# Altium schematic sheet audio.SchDoc
size A3
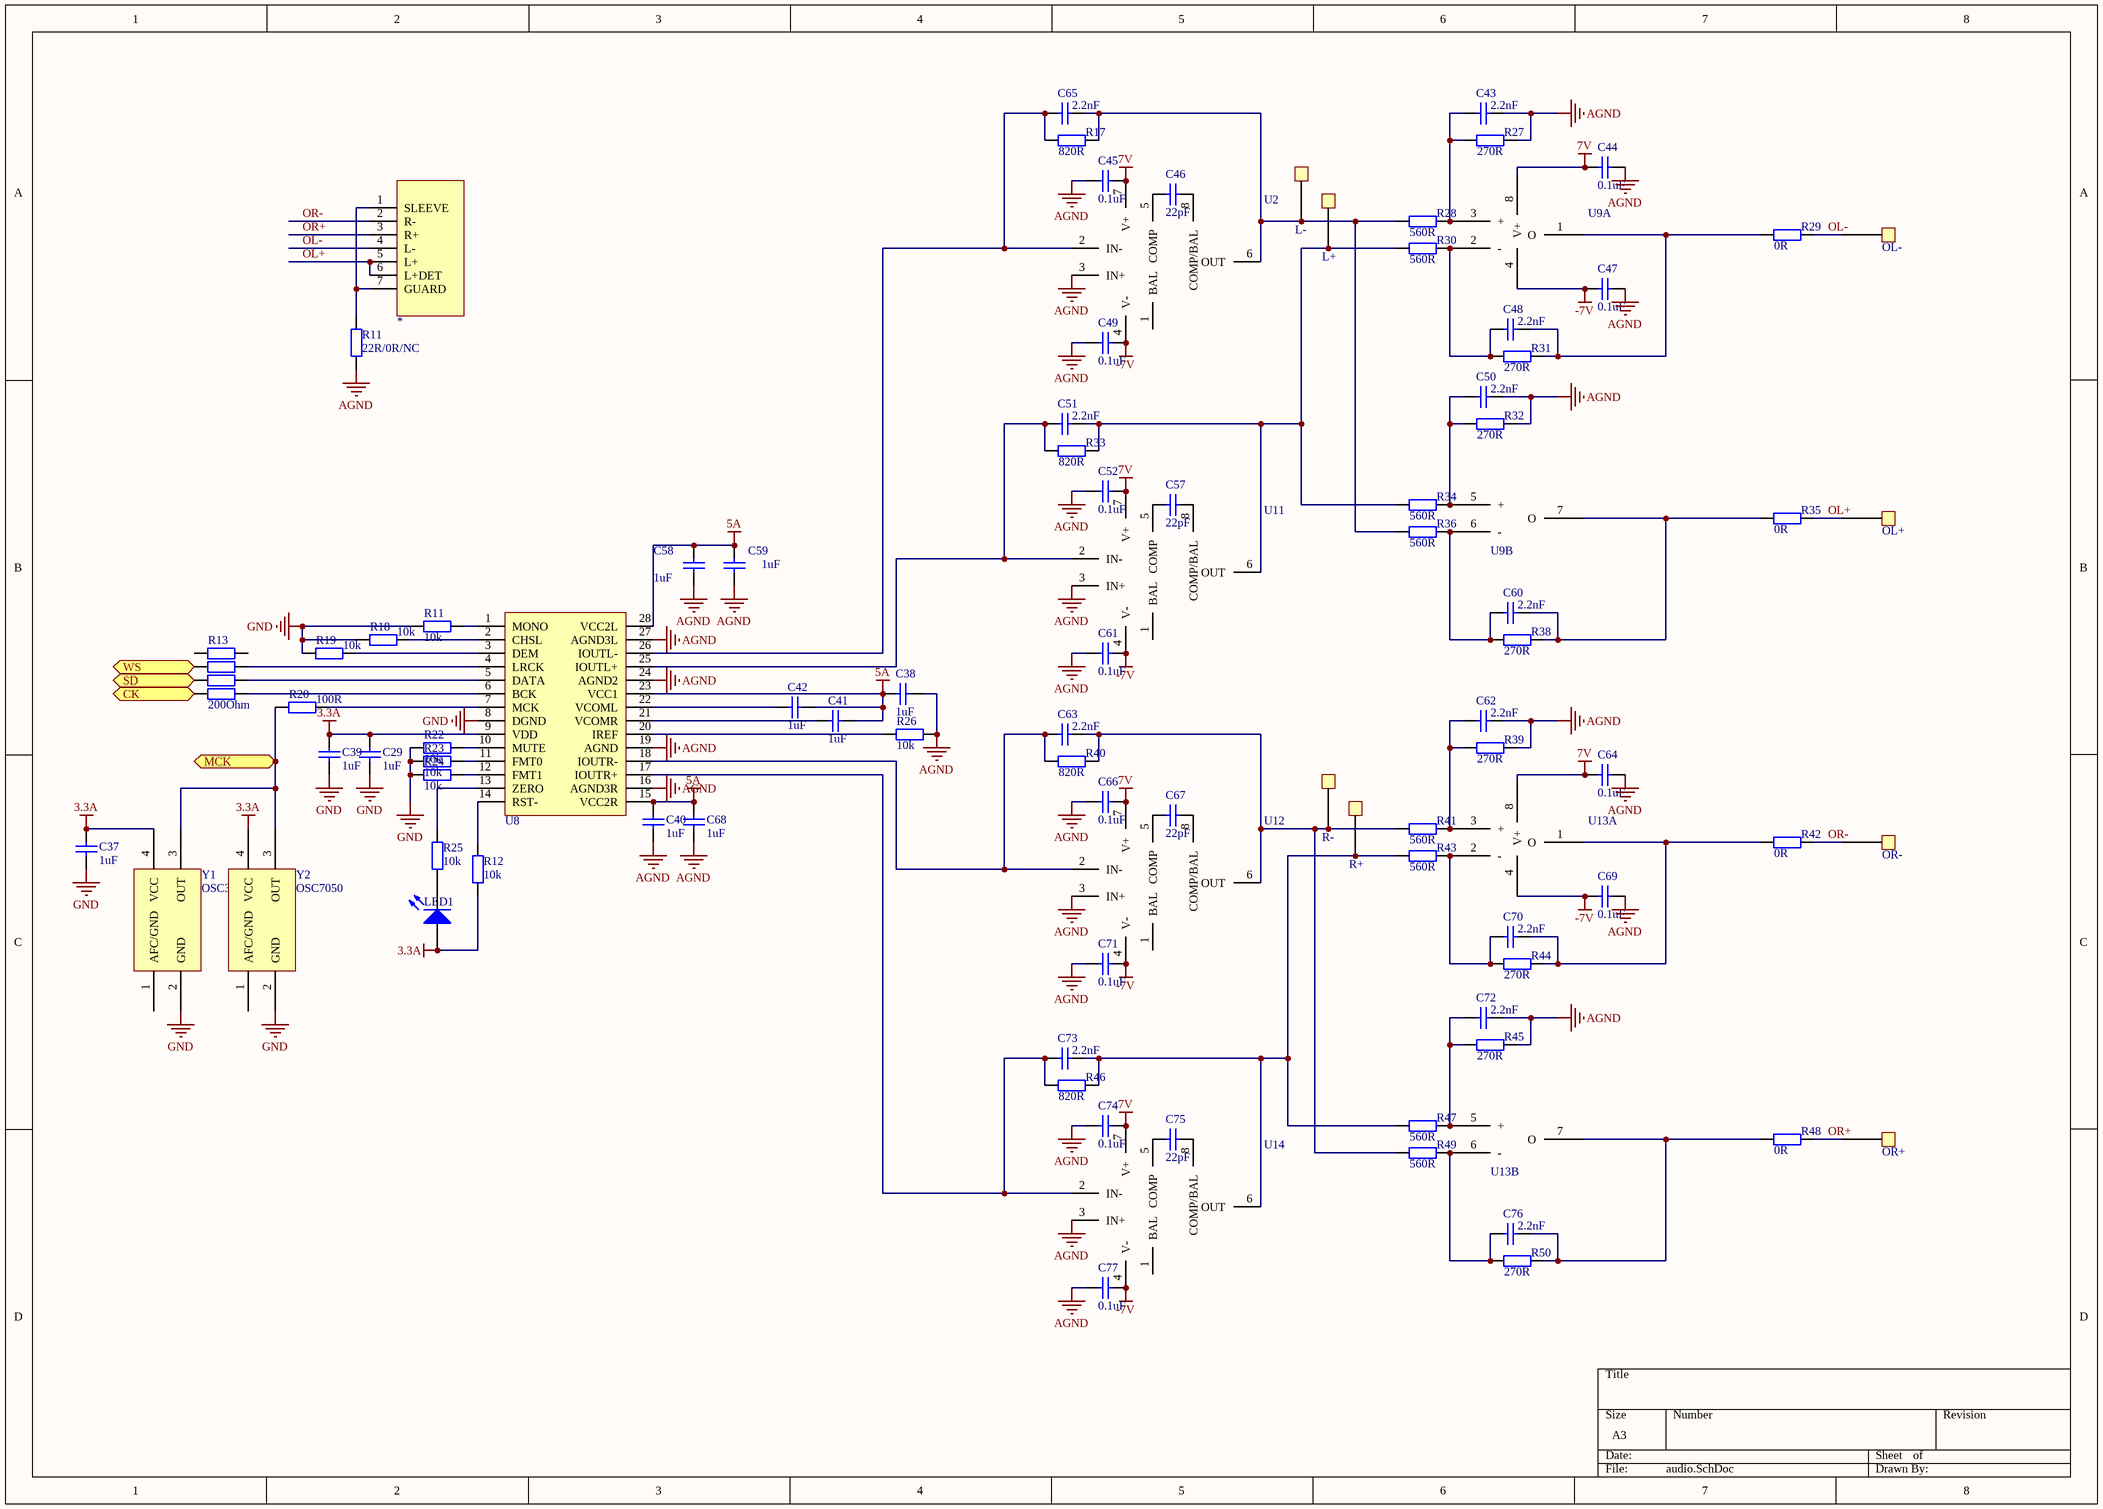
[diagram p0: audio.SchDoc]

## Parts
(Parts that share a designator on the sheet are numbered #1, #2 ... from top to bottom, then left to right.)
*  4.4BAL  [4.4BAL]  (value not drawn)
C29  1uF  [0402]
C37  1uF  [0402]
C38  1uF  [0603L]
C39  1uF  [0402]
C40  1uF  [0402]
C41  1uF  [1206]
C42  1uF  [1206]
C43  2.2nF  [0805]
C44  0.1uF  [0402]
C45  0.1uF  [0402]
C46  22pF  [0402]
C47  0.1uF  [0402]
C48  2.2nF  [0805]
C49  0.1uF  [0402]
C50  2.2nF  [0805]
C51  2.2nF  [0805]
C52  0.1uF  [0402]
C57  22pF  [0402]
C58  1uF  [0402]
C59  1uF  [0603L]
C60  2.2nF  [0805]
C61  0.1uF  [0402]
C62  2.2nF  [0805]
C63  2.2nF  [0805]
C64  0.1uF  [0402]
C65  2.2nF  [0805]
C66  0.1uF  [0402]
C67  22pF  [0402]
C68  1uF  [0603L]
C69  0.1uF  [0402]
C70  2.2nF  [0805]
C71  0.1uF  [0402]
C72  2.2nF  [0805]
C73  2.2nF  [0805]
C74  0.1uF  [0402]
C75  22pF  [0402]
C76  2.2nF  [0805]
C77  0.1uF  [0402]
L+  TestPad  [TestPad]  (value not drawn)
L-  TestPad  [TestPad]  (value not drawn)
LED1  LED0  [0603]  (value not drawn)
OL+  TestPad  [TestPad]  (value not drawn)
OL-  TestPad  [TestPad]  (value not drawn)
OR+  TestPad  [TestPad]  (value not drawn)
OR-  TestPad  [TestPad]  (value not drawn)
R11#1  22R/0R/NC  [0603L]
R11#2  10k  [0402]
R12  10k  [0402]
R13  value 200Ohm  [0402X4]  (hidden comment: Res*4)
R17  820R  [0402]
R18  10k  [0402]
R19  10k  [0402]
R20  100R  [0402]
R22  10k  [0402]
R23  10k  [0402]
R24  10k  [0402]
R25  10k  [0402]
R26  10k  [0603L]
R27  270R  [0402]
R28  560R  [0402]
R29  0R  [0603L]
R30  560R  [0402]
R31  270R  [0402]
R32  270R  [0402]
R33  820R  [0402]
R34  560R  [0402]
R35  0R  [0603L]
R36  560R  [0402]
R38  270R  [0402]
R39  270R  [0402]
R40  820R  [0402]
R41  560R  [0402]
R42  0R  [0603L]
R43  560R  [0402]
R44  270R  [0402]
R45  270R  [0402]
R46  820R  [0402]
R47  560R  [0402]
R48  0R  [0603L]
R49  560R  [0402]
R50  270R  [0402]
R+  TestPad  [TestPad]  (value not drawn)
R-  TestPad  [TestPad]  (value not drawn)
U2  NE5534  [SO8]  (value not drawn)
U8  PCM1794  [PCM1794]  (value not drawn)
U9  OP-2  [SO8]  (value not drawn)  (parts A,B of 2)
U11  NE5534  [SO8]  (value not drawn)
U12  NE5534  [SO8]  (value not drawn)
U13  OP-2  [SO8]  (value not drawn)  (parts A,B of 2)
U14  NE5534  [SO8]  (value not drawn)
Y1  OSC3225  [TXC_7Q]
Y2  OSC7050  [OSC7050]

## Ports
CK, MCK, SD, WS

## Nets
3.3A: C29.2 C37.2 C39.2 LED1.1(A) R12.1 U8.9(VDD) Y1.4(VCC) Y2.4(VCC)
5A: C38.1 C40.1 C41.2 C42.2 C58.1 C59.1 C68.1 U8.15(VCC2R) U8.23(VCC1) U8.28(VCC2L)
7V: C44.1 C45.2 C52.2 C64.1 C66.2 C74.2 U2.7(V+) U9.8(V+) U11.7(V+) U12.7(V+) U13.8(V+) U14.7(V+)
-7V: C47.1 C49.2 C61.2 C69.1 C71.2 C77.2 U2.4(V-) U9.4 U11.4(V-) U12.4(V-) U13.4 U14.4(V-)
AGND: C38.2 C40.2 C43.2 C44.2 C45.1 C47.2 C49.1 C50.2 C52.1 C58.2 C59.2 C61.1 C62.2 C64.2 C66.1 C68.2 C69.2 C71.1 C72.2 C74.1 C77.1 R11#1.2 R26.1 R27.1 R32.1 R39.1 R45.1 U2.3(IN+) U8.16(AGND3R) U8.19(AGND) U8.24(AGND2) U8.27(AGND3L) U11.3(IN+) U12.3(IN+) U14.3(IN+)
GND: C29.1 C37.1 C39.1 R11#2.2 R18.1 R19.1 R22.2 R23.2 R24.2 U8.8(DGND) Y1.2(GND) Y2.2(GND)
CK: R13.5 ; port CK
MCK: R20.1 Y1.3(OUT) Y2.3(OUT) ; port MCK
OL+: *.5(L+) *.6(L+DET) OL+.1 R35.1
OL-: *.4(L-) OL-.1 R29.1
OR+: *.3(R+) OR+.1 R48.1
OR-: *.2(R-) OR-.1 R42.1
SD: R13.6 ; port SD
WS: R13.7 ; port WS
Net*_1: *.1(SLEEVE) *.7(GUARD) R11#1.1
NetC41_1: C41.1 U8.21(VCOMR)
NetC42_1: C42.1 U8.22(VCOML)
NetC43_1: C43.1 R27.2 R28.1 U9.3(+)
NetC46_1: C46.1 U2.5(COMP)
NetC46_2: C46.2 U2.8(COMP/BAL)
NetC48_1: C48.1 R30.1 R31.2 U9.2(-)
NetC48_2: C48.2 R29.2 R31.1 U9.1(O)
NetC50_1: C50.1 R32.2 R34.1 U9.5(+)
NetC51_1: C51.1 R33.2 U8.25(IOUTL+) U11.2(IN-)
NetC51_2: C51.2 L+.1 R30.2 R33.1 R34.2 U11.6(OUT)
NetC57_1: C57.1 U11.5(COMP)
NetC57_2: C57.2 U11.8(COMP/BAL)
NetC60_1: C60.1 R36.1 R38.2 U9.6(-)
NetC60_2: C60.2 R35.2 R38.1 U9.7(O)
NetC62_1: C62.1 R39.2 R41.1 U13.3(+)
NetC63_1: C63.1 R40.2 U8.18(IOUTR-) U12.2(IN-)
NetC63_2: C63.2 R40.1 R41.2 R49.2 R-.1 U12.6(OUT)
NetC65_1: C65.1 R17.2 U2.2(IN-) U8.26(IOUTL-)
NetC65_2: C65.2 L-.1 R17.1 R28.2 R36.2 U2.6(OUT)
NetC67_1: C67.1 U12.5(COMP)
NetC67_2: C67.2 U12.8(COMP/BAL)
NetC70_1: C70.1 R43.1 R44.2 U13.2(-)
NetC70_2: C70.2 R42.2 R44.1 U13.1(O)
NetC72_1: C72.1 R45.2 R47.1 U13.5(+)
NetC73_1: C73.1 R46.2 U8.17(IOUTR+) U14.2(IN-)
NetC73_2: C73.2 R43.2 R46.1 R47.2 R+.1 U14.6(OUT)
NetC75_1: C75.1 U14.5(COMP)
NetC75_2: C75.2 U14.8(COMP/BAL)
NetC76_1: C76.1 R49.1 R50.2 U13.6(-)
NetC76_2: C76.2 R48.2 R50.1 U13.7(O)
NetLED1_2: LED1.2(K) R25.1
NetR11#2_1: R11#2.1 U8.1(MONO)
NetR12_2: R12.2 U8.14(RST-)
NetR13_2: R13.2 U8.4(LRCK)
NetR13_3: R13.3 U8.5(DATA)
NetR13_4: R13.4 U8.6(BCK)
NetR18_2: R18.2 U8.2(CHSL)
NetR19_2: R19.2 U8.3(DEM)
NetR20_2: R20.2 U8.7(MCK)
NetR22_1: R22.1 U8.10(MUTE)
NetR23_1: R23.1 U8.11(FMT0)
NetR24_1: R24.1 U8.12(FMT1)
NetR25_2: R25.2 U8.13(ZERO)
NetR26_2: R26.2 U8.20(IREF)

Not connected (* = marked no-connect by the designer): R13 1 8; U2 1(BAL); U11 1(BAL); U12 1(BAL); U14 1(BAL); Y1 1(AFC/GND); Y2 1(AFC/GND)

## Library data of the parts
C29 C37-C52 C57-C77 = Cap: Capacitor
LED1 = LED0: Typical INFRARED GaAs LED; Published: 8-Jun-2000; LatestRevisionDate: 08-Jul-2005; LatestRevisionNote: Mech Layer 1 removed.; PackageReference: LED-0; Publisher: Altium Limited; PackageDescription: LED; 2 Leads
R11#1 R11#2 R12 R17-R20 R22-R36 R38-R50 = Res2: Resistor; Value: 0Ohm; Published: 8-Jun-2000; LatestRevisionDate: 17-Jul-2002; LatestRevisionNote: Re-released for DXP Platform.; PackageReference: AXIAL-0.4; Publisher: Altium Limited; PackageDescription: Axial Device, Thru-Hole; 2 Leads; 0.4 in Pin Spacing
R13 = Res*4: Resistor; Published: 8-Jun-2000; LatestRevisionDate: 17-Jul-2002; LatestRevisionNote: Re-released for DXP Platform.; PackageReference: AXIAL-0.4; Publisher: Altium Limited; PackageDescription: Axial Device, Thru-Hole; 2 Leads; 0.4 in Pin Spacing
Y1 Y2 = OSC_40M